# EAGLE design AudioThrowie (EAGLE 7.5.0)
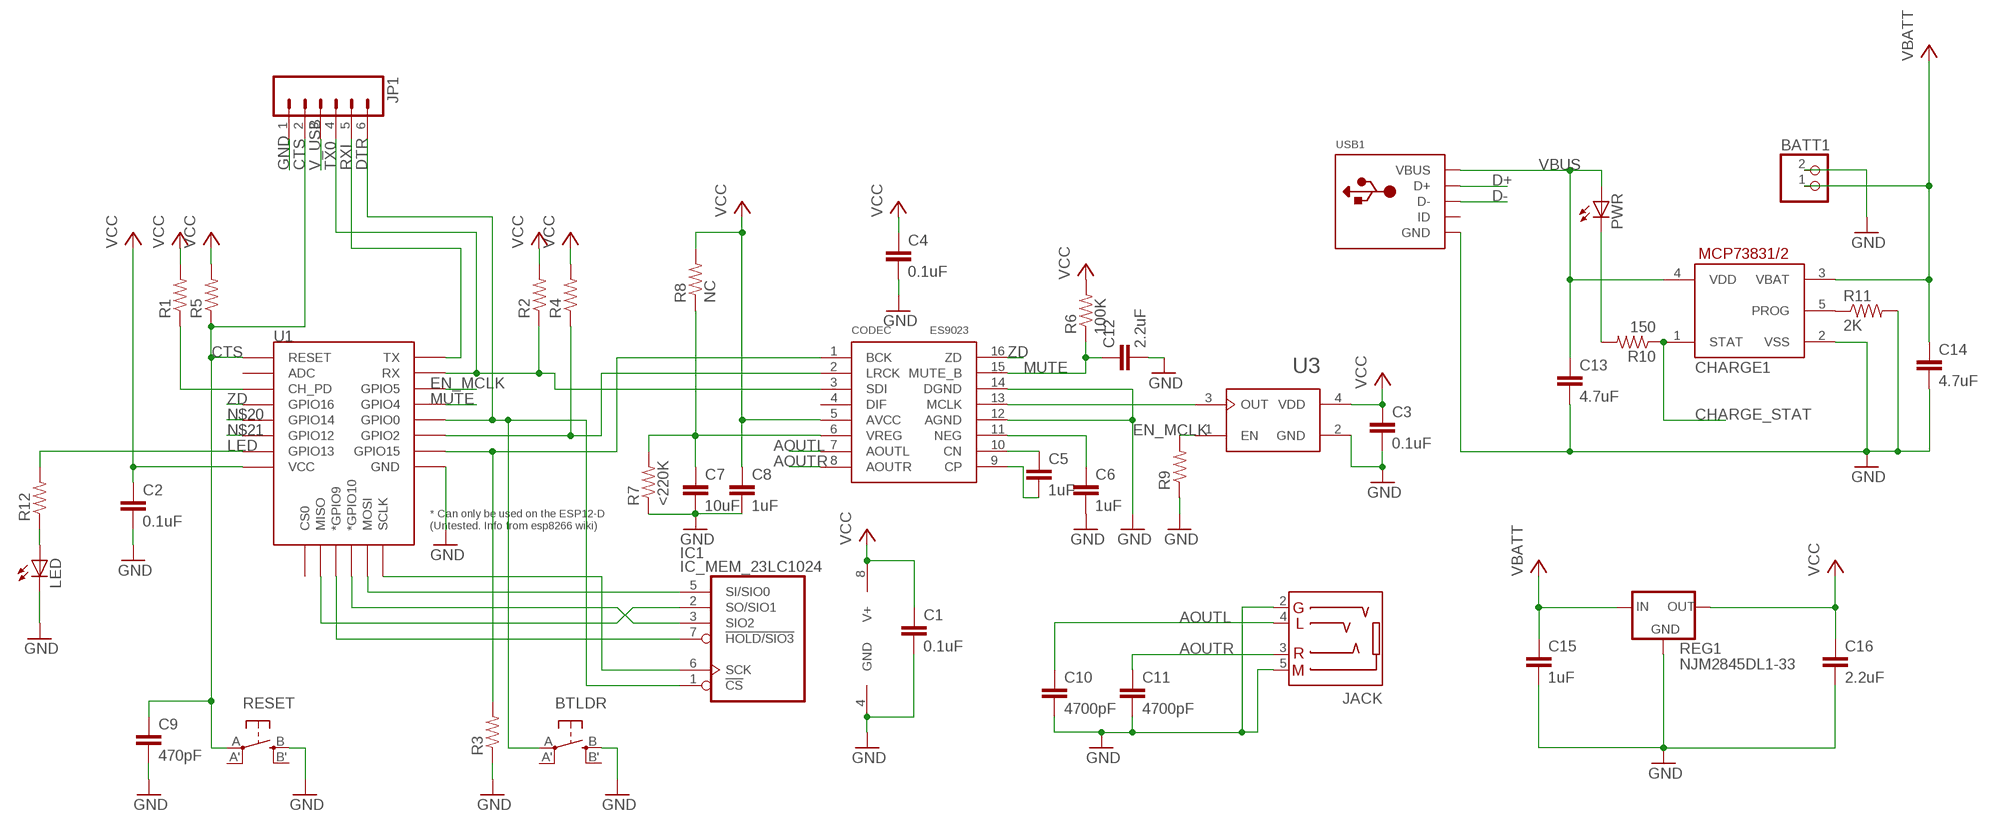
[diagram p0: schematic, sheet 1]

## Parts
BATT1  JST_2PIN-THM  [JST-PH-2-THM]
BTLDR  SPST_TACT-EVQQ2  [EVQ-Q2]
C1  0.1uF  CAP0805  [0805]
C2  0.1uF  CAP0805  [0805]
C3  0.1uF  CAP0805  [0805]
C4  0.1uF  CAP0805  [0805]
C5  1uF  CAP0805  [0805]
C6  1uF  CAP0805  [0805]
C7  10uF  CAP0805  [0805]
C8  1uF  CAP0805  [0805]
C9  470pF  CAP0805  [0805]
C10  4700pF  CAP0805  [0805]
C11  4700pF  CAP0805  [0805]
C12  2.2uF  CAP0805  [0805]
C13  4.7uF  CAP0805  [0805]
C14  4.7uF  CAP0805  [0805]
C15  1uF  CAP0805  [0805]
C16  2.2uF  CAP0805  [0805]
CHARGE1  MCP73831/OT  [SOT23-5L]
CODEC  ES9023  [SOP16]
IC1  IC_MEM_23LC1024  [SOIC-8]
JACK  AUDIO-STEREO-JACK-3.5MM-4SLEEVES  [PJ320D]
JP1  M06LONGPADS  [1X06_LONGPADS]
LED  LED3MM  [LED3MM]
PWR  LED3MM  [LED3MM]
R1  R-US_M0805  [M0805]
R2  R-US_M0805  [M0805]
R3  R-US_M0805  [M0805]
R4  R-US_M0805  [M0805]
R5  R-US_M0805  [M0805]
R6  100K  R-US_M0805  [M0805]
R7  <220K  R-US_M0805  [M0805]
R8  NC  R-US_M0805  [M0805]
R9  R-US_M0805  [M0805]
R10  150  R-US_R0805  [R0805]
R11  2K  R-US_R0603  [R0603]
R12  R-US_M0805  [M0805]
REG1  NJM2845DL1-33  LP2950CDT-3.3  [DPACK]
RESET  SPST_TACT-EVQQ2  [EVQ-Q2]
U1  ESP12ESMD  [ESP12E-SMD]
U3  OSCILLATOR-AW-2.5X2  [AW-CRYSTAL-2.5X2]
USB1  USBMINIB  [USB-MINIB]

## Nets
AOUTL: C10.1 CODEC.7(AOUTL) JACK.4(TIP)
AOUTR: C11.1 CODEC.8(AOUTR) JACK.3(RING1)
CHARGE_STAT: CHARGE1.1(STAT) R10.1
CTS: C9.1 JP1.2 R5.1 RESET.A(P) U1.RESET
D+: USB1.D+
D-: USB1.D-
DTR: BTLDR.A(P) IC1.1(!CS) JP1.6 U1.GPIO0
EN_MCLK: R9.2 U1.GPIO5 U3.1(EN)
GND: BATT1.2 BTLDR.B(S) C1.2 C2.2 C3.2 C4.2 C6.2 C7.2 C8.2 C9.2 C10.2 C11.2 C12.2 C13.2 C14.2 C15.2 C16.2 CHARGE1.2(VSS) CODEC.12(AGND) CODEC.14(DGND) IC1.4(GND) JACK.2(RING2) JACK.5(SLEEVE) JP1.1 LED.K(C) R3.1 R7.1 R9.1 R11.2 REG1.4(GND) RESET.B(S) U1.GND U3.2(GND) USB1.GND
LED: R12.2 U1.GPIO13
MUTE: C12.1 CODEC.15(MUTE_B) R6.1 U1.GPIO4
N$1: C5.1 CODEC.10(CN)
N$2: IC1.2(SO/SIO1) U1.MISO
N$3: IC1.3(SIO2) U1.GPIO10(*GPIO10)
N$4: IC1.5(SI/SIO0) U1.MOSI
N$5: IC1.6(SCK) U1.SCLK
N$6: IC1.7(!HOLD/SIO3) U1.GPIO9(*GPIO9)
N$7: CODEC.2(LRCK) R4.1 U1.GPIO2
N$8: C5.2 CODEC.9(CP)
N$9: CODEC.1(BCK) R3.2 U1.GPIO15
N$10: CODEC.13(MCLK) U3.3(OUT)
N$11: C6.1 CODEC.11(NEG)
N$12: R1.1 U1.CH_PD
N$13: PWR.K(C) R10.2
N$14: CHARGE1.5(PROG) R11.1
N$15: C7.1 CODEC.6(VREG) R7.2 R8.1
N$16: LED.A R12.1
N$20: U1.GPIO14
N$21: U1.GPIO12
RXI: JP1.5 U1.TXD0(TX)
TX0: CODEC.3(SDI) JP1.4 R2.1 U1.RXD0(RX)
V_USB: JP1.3
VBATT: BATT1.1 C14.1 C15.1 CHARGE1.3(VBAT) REG1.1(IN)
VBUS: C13.1 CHARGE1.4(VDD) PWR.A USB1.VBUS
VCC: C1.1 C2.1 C3.1 C4.1 C8.1 C16.1 CODEC.5(AVCC) IC1.8(V+) R1.2 R2.2 R4.2 R5.2 R6.2 R8.2 REG1.3(OUT) U1.VCC U3.4(VDD)
ZD: CODEC.16(ZD) U1.GPIO16
Unconnected: BTLDR.A'(P1) BTLDR.B'(S1) CODEC.4(DIF) RESET.A'(P1) RESET.B'(S1) U1.ADC U1.CS0 USB1.ID

## Library data of the parts
BATT1 = adafruit:JST_2PIN: JST 2-Pin Connectors of various flavors SMT-RA (S2B-PH-SM4) 4UConnector #17311 SMT (B2B-PH-SM4) THM-RA (S2B-PH) THM (B2B-PH)
BTLDR RESET = adafruit:SPST_TACT: SMT 6mm switch, EVQQ2 series http://www.ladyada.net/library/eagle
C1-C16 = SparkFun:CAP: Capacitor Standard 0603 ceramic capacitor, and 0.1" leaded capacitor.
CHARGE1 = adafruit:MCP73831: MCP73831/2 Miniature Single-Cell, Fully Integrated Li-Ion, Li-Polymer Charge Management Controllers. Nice and small simple lipoly charge controller, with adjustable current and status output (LED) http://www.ladyada.net/library/pcb/eaglelibrary.html
CODEC = Robin:ES9023
IC1 = dp_devices:IC_MEM_23LC1024: 1Mbit SPI SRAM with Serial dual interface and Serial quad interface
JACK = Robin:AUDIO-STEREO-JACK-3.5MM-4SLEEVES
JP1 = SparkFun:M06: Header 6 Standard 6-pin 0.1" header. Use with straight break away headers (SKU : PRT-00116), right angle break away headers (PRT-00553), swiss pins (PRT-00743), machine pins (PRT-00117), and female headers (PRT-00115). Molex polarized connector foot print use with SKU : PRT-08094 with associated crimp pins and housings. NOTES ON THE VARIANTS LOCK and LOCK_LONGPADS... This footprint was designed to help hold the alignment of a through-hole component (i.e. 6-pin header) while soldering it into place. You may notice that each hole has been shifted either up or down by 0.005 of an inch from it's more standard position (which is a perfectly straight line). This slight alteration caused the pins (the squares in the middle) to touch the edges of the holes. Because they are alternating, it causes a "brace" to hold the component in place. 0.005 has proven to be the perfect amount of "off-center" position when using our standard breakaway headers. Although looks a little odd when you look at the bare footprint, once you have a header in there, the alteration is very hard to notice. Also, if you push a header all the way into place, it is covered up entirely on the bottom side. This idea of altering the position of holes to aid alignment will be further integrated into the Sparkfun Library for other footprints. It can help hold any component with 3 or more connection pins.
LED PWR = SparkFun:LED: LEDs Standard schematic elements and footprints for 5mm, 3mm, 1206, and 0603 sized LEDs. 5mm - Spark Fun Electronics SKU : COM-00529 (and others)
R1-R12 = adafruit:R-US_: RESISTOR, American symbol
REG1 = v-reg:LP2950?*: Source: http://cache.national.com/ds/LP/LP2950.pdf
U1 = esp8266modules:ESP12E: ESP12E Module
U3 = LCAV:OSCILLATOR: Oscillator AW-2.5x2 TC-3.2x2.5
USB1 = adafruit:USB: USB Connectors USBMINIB - Surface Mount Female Mini-B USB Connector 4UConnector: 06564 By microbuilder.eu Thru-hole RA Female Mini-B USB Connector 4UConnector: 18732 By ladyada.net

## Board
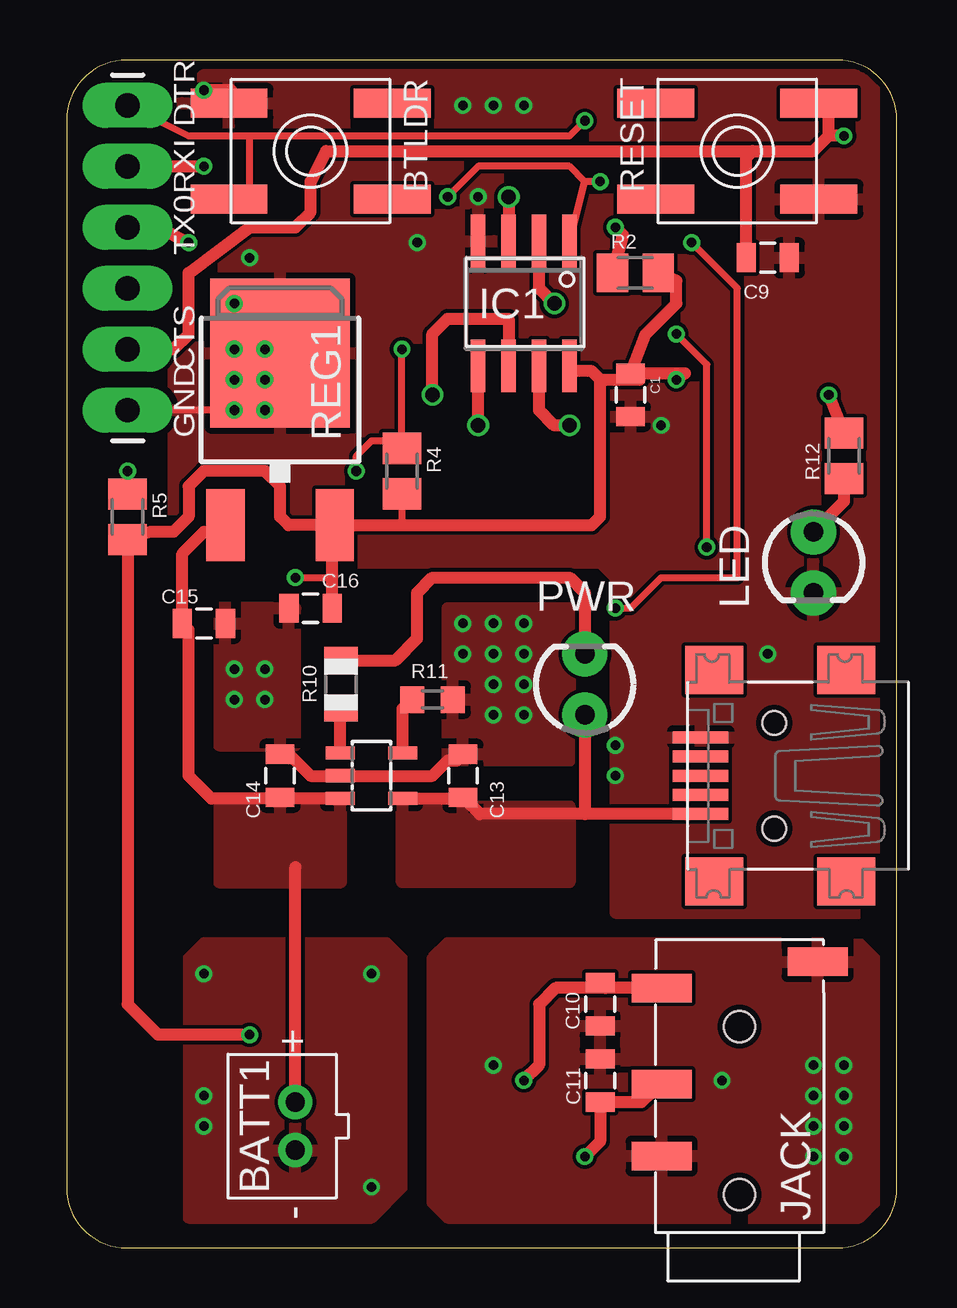
[diagram p1: board, top side]
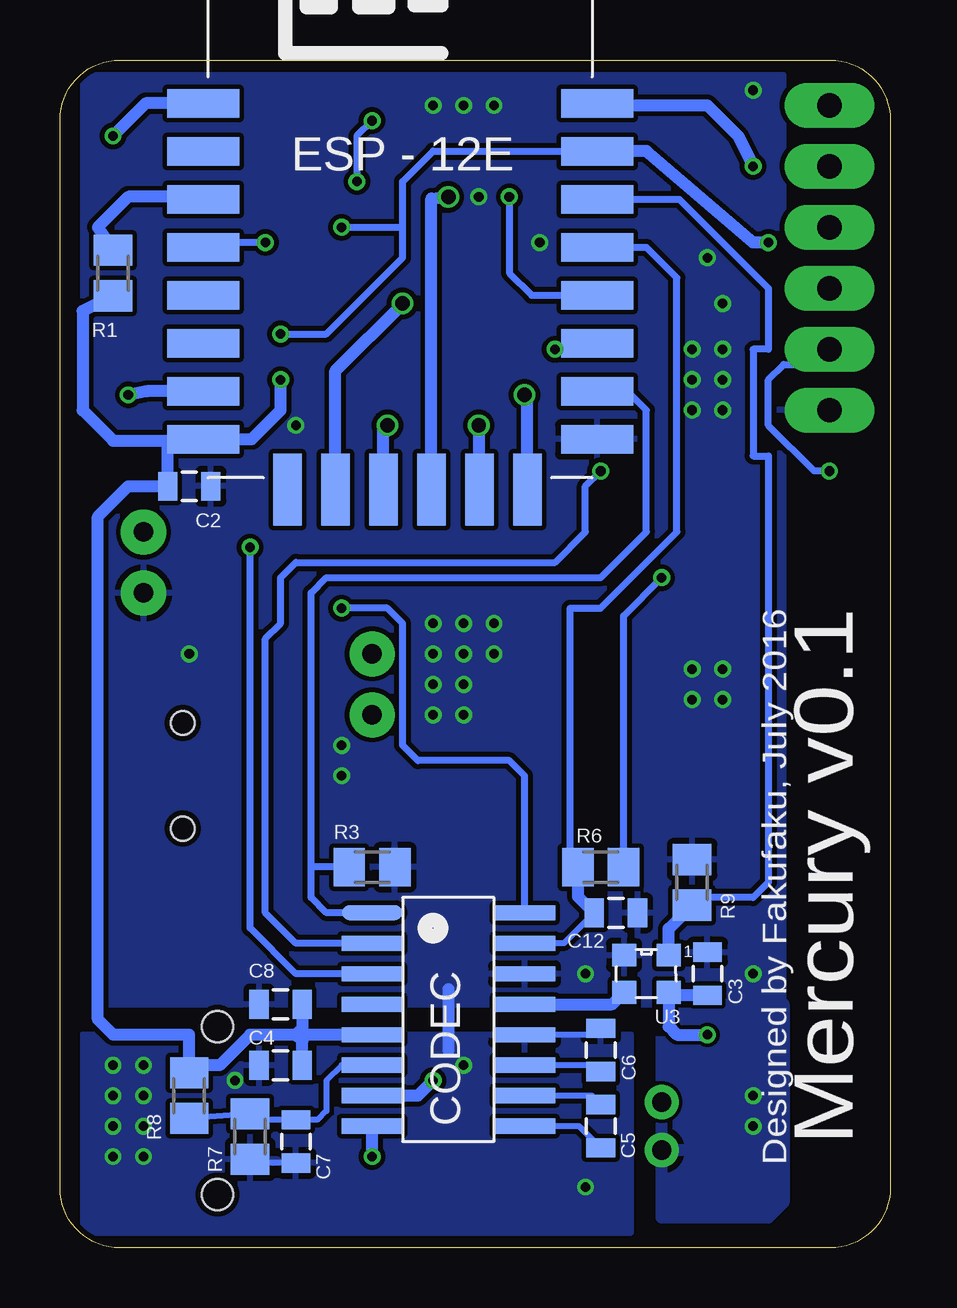
[diagram p2: board, bottom side, seen from below]

Size 34.59 x 49.52 mm. Coordinates in mm from the lower left corner, seen from the top.
Outline: 0,47.02 0,2.5 arc90 2.5,0 32.09,0 arc90 34.59,2.5 34.59,47.02 arc90 32.09,49.52 2.5,49.52 arc90 0,47.02
Copper layers (1*16): Top 0.035mm / dielectric 1.5mm / Bottom 0.035mm
Design rules "SeeedStudio_2layer_DRU_no_angle_20140221": minimum track width 6mil, minimum drill 12mil, track to track 6mil, track to pad 6mil, pad to pad 6mil, via to via 6mil, smd to smd 0mil, copper to edge 10mil, drill to drill 10mil, minimum pad ring 10mil, minimum via ring 6mil, stop-mask expansion 2mil, vias tented up to drill 100mil, thermal gap 10mil

### Footprints (pad centres in the part's own frame; a part is rotated, then mirrored left to right if it is on the bottom)
JST-PH-2-THM = drill 0.8 pad 1.422: 1 1,0; 2 -1,0
EVQ-Q2 = smd 3.2 x 1.2: A -3.4,-2; A' 3.4,-2; B -3.4,2; B' 3.4,2
0805 = smd 0.8 x 1.2: 1 -0.9,0; 2 0.9,0
SOT23-5L = smd 0.55 x 1.2: 1 -0.95,-1.3; 2 0,-1.3; 3 0.95,-1.3; 4 0.95,1.3; 5 -0.95,1.3
SOP16 = smd 0.635 x 2.54: 1 -0.635,-2.54; 2 0.635,-2.54; 3 1.905,-2.54; 4 3.175,-2.54; 5 4.445,-2.54; 6 5.715,-2.54; 7 6.985,-2.54; 8 8.255,-2.54; 9 8.255,3.81; 10 6.985,3.81; 11 5.715,3.81; 12 4.445,3.81; 13 3.175,3.81; 14 1.905,3.81; 15 0.635,3.81; 16 -0.635,3.81
SOIC-8 = smd 0.6 x 2.2: 1 -1.905,-2.6; 2 -0.635,-2.6; 3 0.635,-2.6; 4 1.905,-2.6; 5 1.905,2.6; 6 0.635,2.6; 7 -0.635,2.6; 8 -1.905,2.6
PJ320D = smd 1.2 x 2.5: 2 3.2,3.25; 3 6.2,3.25; 4 10.2,3.25; 5 11.3,-3.25 | hole 1.3: 1.6,0; 8.6,0
1X06_LONGPADS = drill 1.016 pad 1.88 long: 1 0,0; 2 2.54,0; 3 5.08,0; 4 7.62,0; 5 10.16,0; 6 12.7,0
LED3MM = drill 0.813 pad 1.88: A -1.27,0; K 1.27,0
M0805 = smd 1.3 x 1.6: 1 -0.95,0; 2 0.95,0
R0805 = smd 1.1 x 1.4: 1 -1,0; 2 1,0
R0603 = smd 1 x 1.1: 1 -0.85,0; 2 0.85,0
DPACK = smd 1.6 x 3: 1 -2.28,-4.8; 3 2.28,-4.8 | smd 5.8 x 6.2: 4 0,2.38
ESP12E-SMD = smd 3 x 1.2: ADC -8.3,3.8; CH_PD -8.3,1.8; GND 8.1,-8.2; GPIO0 8.1,-2.2; GPIO2 8.1,-4.2; GPIO4 8.1,-0.2; GPIO5 8.1,1.8; GPIO12 -8.3,-4.2; GPIO13 -8.3,-6.2; GPIO14 -8.3,-2.2; GPIO15 8.1,-6.2; GPIO16 -8.3,-0.2; RESET -8.3,5.8; RXD0 8.1,3.8; TXD0 8.1,5.8; VCC -8.3,-8.2 | smd 1.2 x 3: CS0 -4.8,-10.3; GPIO9 -0.8,-10.3; GPIO10 1.2,-10.3; MISO -2.8,-10.3; MOSI 3.2,-10.3; SCLK 5.2,-10.3
AW-CRYSTAL-2.5X2 = smd 1 x 0.95: 1 -0.925,-0.775; 2 0.925,-0.775; 3 0.925,0.775; 4 -0.925,0.775
USB-MINIB = smd 0.5 x 2.308: D+ 0,4.064; D- -0.8,4.064; GND 1.6,4.064; ID 0.8,4.064; VBUS -1.6,4.064 | smd 2 x 2.4: GND1 -4.4,-2; GND2 -4.4,3.5; GND3 4.4,3.5; GND4 4.4,-2 | hole 1: -2.2,1; 2.2,1

### Placement (x,y rotation side)
BATT1  9.53,5.08 90 top
BTLDR  10.16,45.72 0 top
C1  23.5,35.56 270 top
C2  29.21,31.75 0 bottom
C3  7.62,11.43 90 bottom
C4  25.4,7.62 180 bottom
C5  12.06,5.08 270 bottom
C6  12.06,8.26 90 bottom
C7  24.77,4.45 270 bottom
C8  25.4,10.16 180 bottom
C9  29.21,41.27 0 top
C10  22.23,10.16 270 top
C11  22.23,6.99 90 top
C12  11.43,13.97 0 bottom
C13  16.51,19.68 90 top
C14  8.89,19.68 90 top
C15  5.71,26.04 0 top
C16  10.16,26.67 180 top
CHARGE1  12.7,19.68 270 top
CODEC  19.05,13.34 270 bottom
IC1  19.05,39.37 180 top
JACK  28.04,0.64 90 top
JP1  2.54,34.92 90 top
LED  31.11,28.57 270 top
PWR  21.59,23.5 90 top
R1  32.38,40.64 270 bottom
R2  23.7,40.64 0 top
R3  21.59,15.88 180 bottom
R4  13.97,32.38 270 top
R5  2.54,30.48 270 top
R6  12.06,15.88 0 bottom
R7  26.67,4.64 90 bottom
R8  29.21,6.35 90 bottom
R9  8.26,15.24 270 bottom
R10  11.43,23.5 90 top
R11  15.24,22.86 0 top
R12  32.38,33.02 90 top
REG1  8.89,34.92 0 top
RESET  27.94,45.72 180 top
U1  20.32,41.91 0 bottom
U3  10.16,11.43 180 bottom
USB1  30.48,19.68 90 top

### Tracks (layer width: path | path; a pad name or v marks a point on that pad's centre or on a via)
AOUTL  (via drill 0.4)
  Top 0.5: JACK.4 22.45,10.84 | 22.45,10.84 C10.1 | 22.45,10.84 20.36,10.84 19.68,10.16 19.68,7.62 v19.05,6.99
  Bottom 0.5: v19.05,6.99 19.68,6.35 CODEC.7
AOUTR  (via drill 0.4)
  Top 0.5: JACK.3 23.94,6.08 C11.1 22.23,4.45 v21.59,3.81
  Bottom 0.5: v21.59,3.81 CODEC.8
CHARGE_STAT
  Top 0.5: CHARGE1.1 11.4,22.46 R10.1
CTS  (via drill 0.4)
  Top 0.3: R5.1 v2.54,32.38
  Top 0.5: JP1.2 4.45,37.47 5.08,38.1 5.08,40.64 7.62,42.55 9.53,42.55 10.16,43.18 10.16,44.45 10.79,45.72 28.57,45.72 | 28.57,45.72 31.11,45.72 31.75,46.35 | 31.75,46.35 31.75,47.31 RESET.A | C9.1 28.31,45.45 28.57,45.72 | v32.38,46.35 31.75,46.35
  Bottom 0.3: v2.54,32.38 3.17,32.38 5.08,34.29 5.08,36.2 4.45,36.83 3.17,36.83 JP1.2
  Bottom 0.5: U1.RESET 31.03,47.71 v32.38,46.35
DTR  (via drill 0.4)
  Top 0.3: IC1.1 21.59,44.45 | 21.59,44.45 20.95,45.09 17.14,45.09 v15.88,43.81 | JP1.6 5.08,46.35 7.62,46.35 | 7.62,46.35 20.95,46.35 v21.59,46.99 | v22.23,44.45 21.59,44.45 | BTLDR.A 7.62,43.95 7.62,46.35
  Bottom 0.3: v15.88,43.81 15.88,40.64 14.95,39.71 U1.GPIO0 | v21.59,46.99 22.23,46.35 v22.23,44.45
EN_MCLK
  Bottom 0.3: U1.GPIO5 8.79,43.71 5.08,40.01 5.08,37.47 5.71,37.47 5.71,33.02 5.08,33.02 5.08,15.24 5.71,14.61 7.94,14.61 R9.2
  Bottom 0.5: U3.1 9.23,13.31 R9.2
GND  (via drill 0.4)
  Top 0.3: v6.99,34.92 JP1.1
  Top 0.5: C14.2 9.26,20.59 10.16,19.68 CHARGE1.2 15.24,19.68 15.88,20.32 16.25,20.32 C13.2 | BTLDR.B 6.86,48.26 v5.71,48.26
  Bottom 0.25: C7.2 26.67,3.54 R7.1 | C6.2 12.33,8.89 CODEC.12
  Bottom 0.5: 18.41,10.79 18.41,8.26
  other vias: 6.99,24.13 8.26,24.13 8.26,22.86 6.99,22.86 16.51,26.04 17.78,26.04 19.05,26.04 19.05,24.77 17.78,24.77 16.51,24.77 17.78,23.5 19.05,23.5 19.05,22.23 17.78,22.23 29.21,24.77 17.14,43.81 6.99,36.2 6.99,37.47 12.7,11.43 5.71,11.43 5.71,6.35 5.71,5.08 12.7,2.54 22.86,19.68 22.86,20.95 8.26,37.47 8.26,36.2 8.26,34.92 31.11,7.62 31.11,6.35 31.11,5.08 31.11,3.81 32.38,7.62 32.38,6.35 32.38,5.08 32.38,3.81 17.78,7.62 24.77,34.29 6.99,39.37 16.51,47.62 17.78,47.62 19.05,47.62 14.61,41.91 7.62,41.27 27.3,6.99
  pour Bottom (isolate 0.2): 10.79,8.89 33.66,8.89 33.66,0.64 10.79,0.64
  pour Bottom (isolate 0.2): 33.66,10.16 4.45,10.16 4.45,48.9 33.66,48.9
  pour Top: 9.53,20.95 9.53,26.67 6.35,26.67 6.35,20.95
  pour Top: 15.88,20.32 15.88,26.67 20.95,26.67 20.95,20.32
  pour Top: 15.88,1.27 33.02,1.27 33.66,1.91 33.66,12.06 33.02,12.7 15.88,12.7 15.24,12.06 15.24,1.91
  pour Top: 22.86,13.97 33.02,13.97 33.66,14.61 33.66,48.26 33.02,48.9 5.71,48.9 4.45,47.62 4.45,29.21 5.08,28.57 22.23,28.57 22.86,27.94
  pour Bottom: 4.45,10.16 4.45,1.91 5.08,1.27 9.53,1.27 9.53,10.16
  pour Top: 5.08,1.27 12.7,1.27 13.97,2.54 13.97,12.06 13.34,12.7 5.71,12.7 5.08,12.06
LED  (via drill 0.4)
  Top 0.5: v31.75,35.56 R12.2
  Bottom 0.5: U1.GPIO13 30.96,35.71 v31.75,35.56
MUTE
  Bottom 0.25: C12.1 13.6,12.7 CODEC.15
  Bottom 0.3: U1.GPIO4 10.16,41.71 8.89,40.44 8.89,29.84 12.06,26.67 13.34,26.67 13.34,16.2 R6.1
  Bottom 0.5: R6.1 13.02,14.65 C12.1
N$1
  Bottom 0.25: C5.1 12.44,6.35 CODEC.10
N$2  (via drill 0.6)
  Top 0.5: v20.32,39.37 19.68,40.01 IC1.2
  Bottom 0.5: U1.MISO 23.12,36.57 v20.32,39.37
N$3  (via drill 0.6)
  Top 0.5: v18.41,43.81 IC1.3
  Bottom 0.5: U1.GPIO10 19.12,43.74 v18.41,43.81
N$4  (via drill 0.6)
  Top 0.5: v17.14,34.29 IC1.5
  Bottom 0.5: U1.MOSI 17.12,34.27 v17.14,34.29
N$5  (via drill 0.6)
  Top 0.5: v15.24,35.56 15.24,38.1 15.88,38.73 18.41,38.73 IC1.6
  Bottom 0.5: U1.SCLK 15.12,35.44 v15.24,35.56
N$6  (via drill 0.6)
  Top 0.5: v20.95,34.29 20.32,34.29 19.68,34.92 IC1.7
  Bottom 0.5: U1.GPIO9 21.12,34.12 v20.95,34.29
N$7  (via drill 0.4)
  Top 0.3: v13.97,37.47 R4.1 13.65,33.66 12.7,33.66 12.06,33.02 v12.06,32.38
  Bottom 0.3: v13.97,37.47 12.46,37.47 U1.GPIO2 | CODEC.2 24.77,12.7 26.04,13.97 26.04,25.4 25.4,26.04 25.4,27.94 24.77,28.57 13.97,28.57 12.7,29.84 12.7,31.75 v12.06,32.38
N$8
  Bottom 0.25: C5.2 12.96,5.08 CODEC.9
N$9
  Bottom 0.3: CODEC.1 23.5,13.97 24.13,14.61 24.13,15.88 | 24.13,15.88 24.13,27.3 23.5,27.94 12.06,27.94 10.16,29.84 10.16,34.92 10.79,35.56 12.07,35.56 U1.GPIO15 | R3.2 24.13,15.88
N$10
  Bottom 0.5: CODEC.13 11.58,10.16 U3.3
N$11
  Bottom 0.25: C6.1 12.33,7.62 CODEC.11
N$12
  Bottom 0.5: U1.CH_PD 29.36,43.81 31.75,43.81 33.02,42.55 R1.1
N$13
  Top 0.5: R10.2 13.7,24.5 14.61,25.4 14.61,27.3 15.24,27.94 20.95,27.94 21.59,27.3 PWR.K
N$14
  Top 0.5: CHARGE1.5 14,22.47 R11.1
N$15
  Bottom 0.25: R8.1 R7.2 26.67,5.34 C7.1 23.86,5.34 23.5,5.71 23.5,6.99 22.86,7.62 CODEC.6
N$16
  Top 0.5: R12.1 32.38,31.11 LED.A
RXI  (via drill 0.4)
  Top 0.5: JP1.5 v5.71,45.09
  Bottom 0.5: U1.TXD0 12.13,47.62 7.62,47.62 6.35,46.35 v5.71,45.09
TX0  (via drill 0.4)
  Top 0.3: v26.67,29.21 26.67,36.83 v25.4,38.1
  Top 0.5: JP1.4 3.81,42.55 v5.08,41.91 | R2.1 23.18,42.23 v22.86,42.55
  Bottom 0.3: CODEC.3 24.77,11.43 26.67,13.34 v26.67,29.21 | v25.4,38.1 23.5,38.1 20.32,41.27 20.32,42.55 | 20.32,42.55 20.32,44.45 19.05,45.72 U1.RXD0 | v22.86,42.55 20.32,42.55
  Bottom 0.5: v5.08,41.91 5.71,41.91 10.16,45.72 U1.RXD0
VBATT
  Top 0.5: CHARGE1.3 8.94,18.73 | 8.94,18.73 C14.1 | 8.94,18.73 6.03,18.73 5.08,19.68 5.08,25.77 C15.1 4.82,28.95 5.71,29.84 6.33,29.84 REG1.1 | BATT1.1 9.53,15.88
  pour Top: 11.43,15.24 11.43,18.41 6.35,18.41 6.35,15.24
VBUS
  Top 0.5: CHARGE1.4 16.46,18.73 C13.1 17.21,18.09 21.59,18.09 | USB1.VBUS 21.59,18.09 | PWR.A 21.59,18.09
  pour Top: 13.97,15.24 13.97,18.41 20.95,18.41 20.95,15.24
VCC  (via drill 0.4)
  Top 0.3: R4.2 13.97,30.12 | v9.53,27.94 11.06,27.94
  Top 0.5: C16.1 11.06,27.94 11.06,30.02 REG1.3 | IC1.8 21.16,36.56 21.86,36.56 22.23,36.2 | REG1.3 9.24,30.12 8.89,30.48 8.89,31.75 8.26,32.38 5.71,32.38 5.08,31.75 5.08,30.48 4.45,29.84 3.49,29.84 R5.2 | REG1.3 13.97,30.12 21.87,30.12 22.23,30.48 22.23,36.2 | v7.62,8.89 3.81,8.89 2.54,10.16 R5.2 | 22.23,36.2 23.86,36.2 C1.1 | C1.1 24.13,38.1 25.4,39.37 25.4,40.32 R2.2 | C1.1 25.77,36.46 v25.4,36.2 | 3.17,29.84 R5.2
  Bottom 0.3: R6.2 11.12,26.35 v9.53,27.94
  Bottom 0.5: C8.1 24.5,9.15 24.77,8.89 | C4.1 24.5,8.62 24.77,8.89 | C3.1 9.11,10.53 U3.4 9.23,9.23 8.89,8.89 v7.62,8.89 | v25.4,36.2 25.4,34.92 26.61,33.71 U1.VCC 28.68,33.66 29.84,33.66 | 29.84,33.66 30.11,33.39 C2.1 31.75,31.75 33.02,30.48 33.02,9.53 32.38,8.89 29.21,8.89 R8.2 28.89,7.62 27.94,7.62 26.67,8.89 24.77,8.89 | CODEC.5 24.77,8.89 | R1.2 33.66,39.05 33.66,34.92 32.38,33.66 29.84,33.66
ZD  (via drill 0.4)
  Top 0.3: v22.86,26.67 23.5,26.67 24.77,27.94 27.94,27.94 27.94,40.01 v26.04,41.91
  Bottom 0.3: CODEC.16 15.24,19.68 15.88,20.32 19.68,20.32 20.32,20.95 20.32,26.04 20.95,26.67 v22.86,26.67 | v26.04,41.91 28.42,41.91 U1.GPIO16

### Text on the board
tPlace: DTR | RXI | TX0 | CTS | GND
bPlace: Mercury v0.1 | Designed by Fakufaku, July 2016